# EAGLE design MJ838 - base - rev.1a (EAGLE 9.6.2)
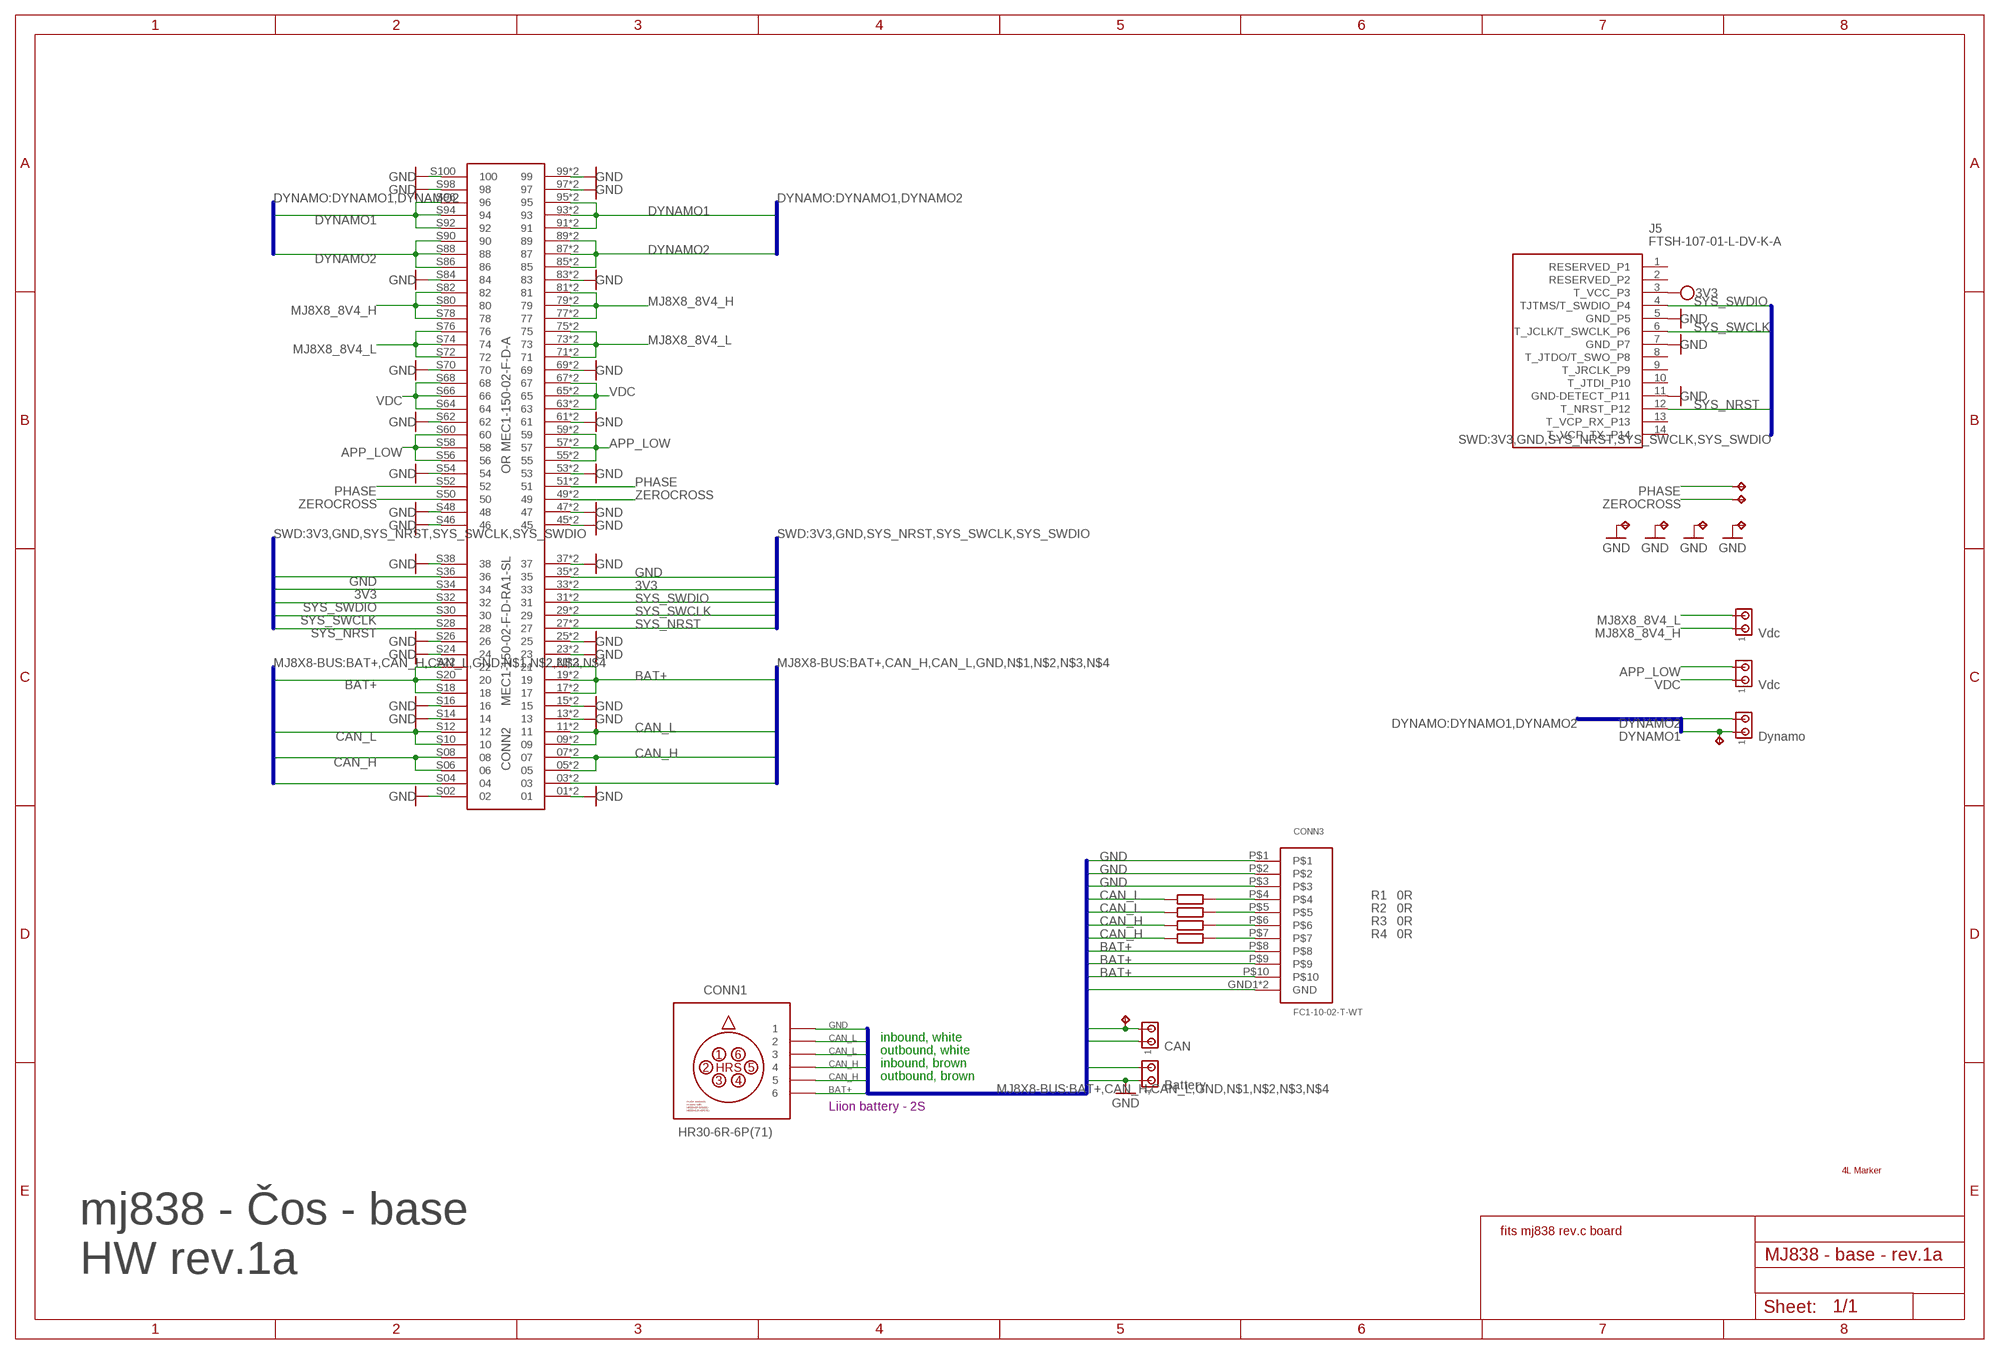
[diagram p0: schematic, sheet 1]

## Parts
CONN1  HR30-6R-6P(71)  HR-30-6R-6X  (no package)
CONN2  MEC1-150-02-F-D-RA1-SL  MEC1-150-02-F-D-AMEC1-150-02-F-D-COMBINED  [MEC1-150-02-F-D-COMBINED]
CONN3  FC1-10-02-T-WT  FC1-10-02-T-FFC_CONNECTOR  [SMD]
J2  Dynamo  MTA02-100  [10X02MTA]
J3  CAN  MTA02-100  [10X02MTA]
J4  Battery  MTA02-100  [10X02MTA]
J5  FTSH-107-01-L-DV-K-A  [FTSH10701LDVKA]
J6  Vdc  MTA02-100  [10X02MTA]
J7  Vdc  MTA02-100  [10X02MTA]
MARKER2  4 Layer marker  4L  [4L]
R1  0R  R-EU_R0402  [R0402]
R2  0R  R-EU_R0402  [R0402]
R3  0R  R-EU_R0402  [R0402]
R4  0R  R-EU_R0402  [R0402]
TP1  TPPAD1-13  [P1-13]
TP2  TPPAD1-13  [P1-13]
TP3  TPPAD1-13  [P1-13]
TP4  TPPAD1-13  [P1-13]
TP5  TPPAD1-13  [P1-13]
TP6  TPPAD1-13  [P1-13]
TP8  TPPAD1-13  [P1-13]
TP9  TPPAD1-13  [P1-13]

## Nets
3V3 [3V3]: CONN2.33 CONN2.R33 CONN2.S34 J5.3(T_VCC_P3)
APP_LOW [Vdc]: CONN2.55 CONN2.57 CONN2.59 CONN2.R55 CONN2.R57 CONN2.R59 CONN2.S56 CONN2.S58 CONN2.S60 J7.2
BAT+ [BAT+]: CONN1.6 CONN2.17 CONN2.19 CONN2.21 CONN2.R17 CONN2.R19 CONN2.R21 CONN2.S18 CONN2.S20 CONN2.S22 CONN3.P$8 CONN3.P$9 CONN3.P$10 J4.2
CAN_H [signal]: CONN1.4 CONN1.5 CONN2.05 CONN2.07 CONN2.R05 CONN2.R07 CONN2.S06 CONN2.S08 J3.2 R3.1 R4.1 TP6.TP
CAN_L [signal]: CONN1.2 CONN1.3 CONN2.09 CONN2.11 CONN2.R09 CONN2.R11 CONN2.S10 CONN2.S12 J3.1 R1.1 R2.1
DYNAMO1 [Vdynamo]: CONN2.91 CONN2.93 CONN2.95 CONN2.R91 CONN2.R93 CONN2.R95 CONN2.S92 CONN2.S94 CONN2.S96 J2.1 TP5.TP
DYNAMO2 [Vdynamo]: CONN2.85 CONN2.87 CONN2.89 CONN2.R85 CONN2.R87 CONN2.R89 CONN2.S86 CONN2.S88 CONN2.S90 J2.2
GND: CONN1.1 CONN2.01 CONN2.03 CONN2.13 CONN2.15 CONN2.23 CONN2.25 CONN2.35 CONN2.37 CONN2.45 CONN2.47 CONN2.53 CONN2.61 CONN2.69 CONN2.83 CONN2.97 CONN2.99 CONN2.R01 CONN2.R03 CONN2.R13 CONN2.R15 CONN2.R23 CONN2.R25 CONN2.R35 CONN2.R37 CONN2.R45 CONN2.R47 CONN2.R53 CONN2.R61 CONN2.R69 CONN2.R83 CONN2.R97 CONN2.R99 CONN2.S02 CONN2.S04 CONN2.S14 CONN2.S16 CONN2.S24 CONN2.S26 CONN2.S36 CONN2.S38 CONN2.S46 CONN2.S48 CONN2.S54 CONN2.S62 CONN2.S70 CONN2.S84 CONN2.S98 CONN2.S100 CONN3.GND1(GND) CONN3.GND2(GND) CONN3.P$1 CONN3.P$2 CONN3.P$3 J4.1 J5.5(GND_P5) J5.7(GND_P7) J5.11(GND-DETECT_P11) TP1.TP TP4.TP TP8.TP TP9.TP
MJ8X8_8V4_H [BAT+]: CONN2.77 CONN2.79 CONN2.81 CONN2.R77 CONN2.R79 CONN2.R81 CONN2.S78 CONN2.S80 CONN2.S82 J6.1
MJ8X8_8V4_L [BAT+]: CONN2.71 CONN2.73 CONN2.75 CONN2.R71 CONN2.R73 CONN2.R75 CONN2.S72 CONN2.S74 CONN2.S76 J6.2
N$1 [signal]: CONN3.P$4 R1.2
N$2 [signal]: CONN3.P$5 R2.2
N$3 [signal]: CONN3.P$6 R3.2
N$4 [signal]: CONN3.P$7 R4.2
PHASE [signal]: CONN2.51 CONN2.R51 CONN2.S52 TP3.TP
SYS_NRST [signal]: CONN2.27 CONN2.R27 CONN2.S28 J5.12(T_NRST_P12)
SYS_SWCLK [signal]: CONN2.29 CONN2.R29 CONN2.S30 J5.6(T_JCLK/T_SWCLK_P6)
SYS_SWDIO [signal]: CONN2.31 CONN2.R31 CONN2.S32 J5.4(TJTMS/T_SWDIO_P4)
VDC [Vdc]: CONN2.63 CONN2.65 CONN2.67 CONN2.R63 CONN2.R65 CONN2.R67 CONN2.S64 CONN2.S66 CONN2.S68 J7.1
ZEROCROSS [signal]: CONN2.49 CONN2.R49 CONN2.S50 TP2.TP
Unconnected: J5.1(RESERVED_P1) J5.2(RESERVED_P2) J5.8(T_JTDO/T_SWO_P8) J5.9(T_JRCLK_P9) J5.10(T_JTDI_P10) J5.13(T_VCP_RX_P13) J5.14(T_VCP_TX_P14)

## Buses
MJ8X8-BUS:BAT+,CAN_H,CAN_L,GND,N$1,N$2,N$3,N$4
SWD:3V3,GND,SYS_NRST,SYS_SWCLK,SYS_SWDIO
DYNAMO:DYNAMO1,DYNAMO2

## Notes on the sheet
- OR MEC1-150-02-F-D-A
- inbound, white
- outbound, white
- inbound, brown
- outbound, brown
- Liion battery - 2S
- fits mj838 rev.c board
- mj838 - Čos - base
  HW rev.1a

## Library data of the parts
CONN1 = HR30-6R-6P - PushPull Receptacle:HR-30-6R-6X
CONN2 = MEC1-150-X-X-D-RA1-SL-X:MEC1-150-02-F-D-A
CONN3 = FC1-10-02-T  - FFC Connector:FC1-10-02-T-FFC_CONNECTOR
J2-J4 J6 J7 = con-amp:MTA02-100: AMP connector
J5 = STM32 JTAG 1.27mm 14pin header:FTSH-107-01-L-DV-K-A: Headers & Wire Housings .050" Micro Terminal Strip Source: Datasheet <https://componentsearchengine.com/Datasheets/1/FTSH-107-01-L-DV-K-A.pdf>; DESCRIPTION: Headers & Wire Housings .050" Micro Terminal Strip; HEIGHT: 5.97mm; MANUFACTURER_NAME: SAMTEC; MANUFACTURER_PART_NUMBER: FTSH-107-01-L-DV-K-A; MOUSER_PART_NUMBER: 200-FTSH10701LDVKA; MOUSER_PRICE-STOCK: https://www.mouser.com/Search/Refine.aspx?Keyword=200-FTSH10701LDVKA
MARKER2 = Layer Markers:4L
R1-R4 = rcl:R-EU_: RESISTOR, European symbol; SPICEPREFIX: R
TP1-TP6 TP8 TP9 = testpad:TP: Test pad

## Net classes
0 GND: width 0.25 mm, drill 0.35 mm, clearance 0.19 mm
1 BAT+: width 0.5 mm, drill 0.35 mm, clearance 0.5 mm to class 0, clearance 0.5 mm
2 signal: width 0.25 mm, drill 0.35 mm, clearance 0.19 mm to class 0, clearance 0.19 mm to class 1, clearance 0.19 mm
3 3V3: width 0.25 mm, drill 0.35 mm, clearance 0.19 mm to class 0, clearance 0.19 mm to class 1, clearance 0.19 mm to class 2, clearance 0.19 mm
4 Vdc: width 0.5 mm, drill 0.35 mm, clearance 0.5 mm to class 0, clearance 0.5 mm to class 1, clearance 0.5 mm to class 2, clearance 0.5 mm to class 3, clearance 0.5 mm
5 Vdynamo: width 0.5 mm, drill 0.35 mm, clearance 0.5 mm to class 0, clearance 0.5 mm to class 1, clearance 0.5 mm to class 2, clearance 0.5 mm to class 3, clearance 0.5 mm to class 4, clearance 0.5 mm
6 Vac: width 0.5 mm, drill 0.35 mm, clearance 0.5 mm to class 0, clearance 0.5 mm to class 1, clearance 0.5 mm to class 2, clearance 0.5 mm to class 3, clearance 0.5 mm to class 4, clearance 0.5 mm to class 5, clearance 0.5 mm

## Board
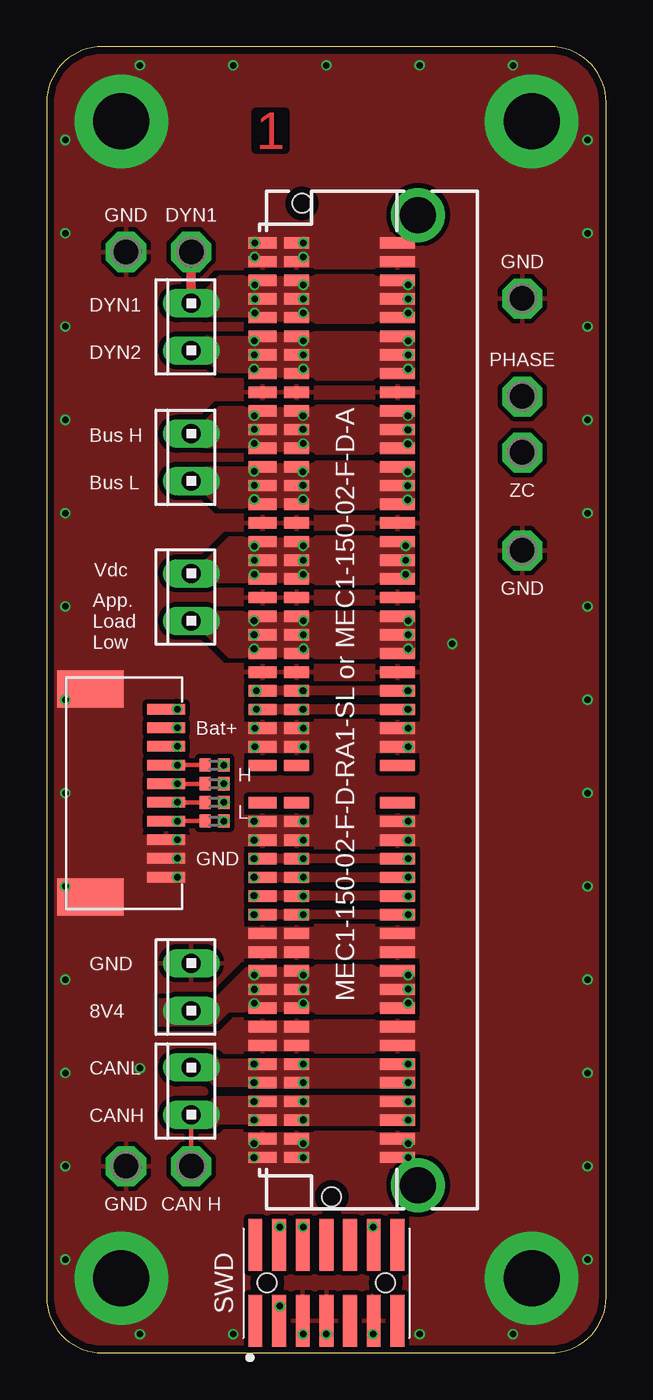
[diagram p1: board, top side]
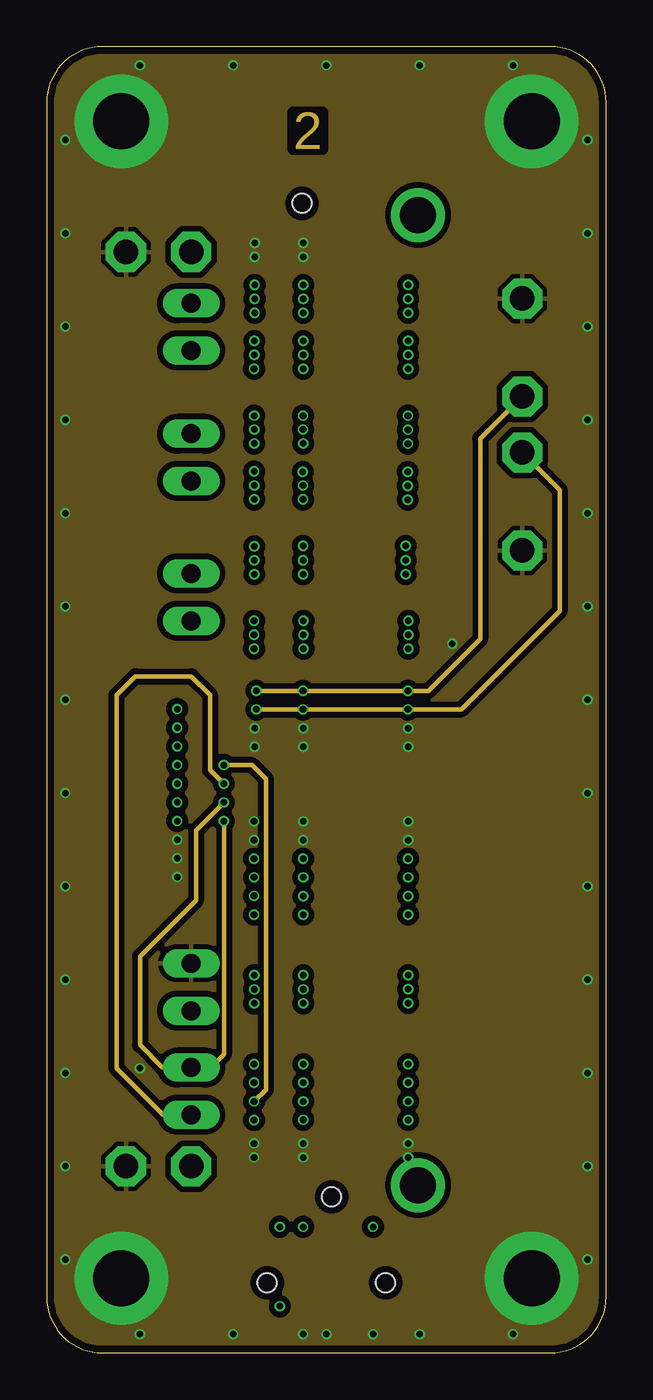
[diagram p2: board, inner layer Route2]
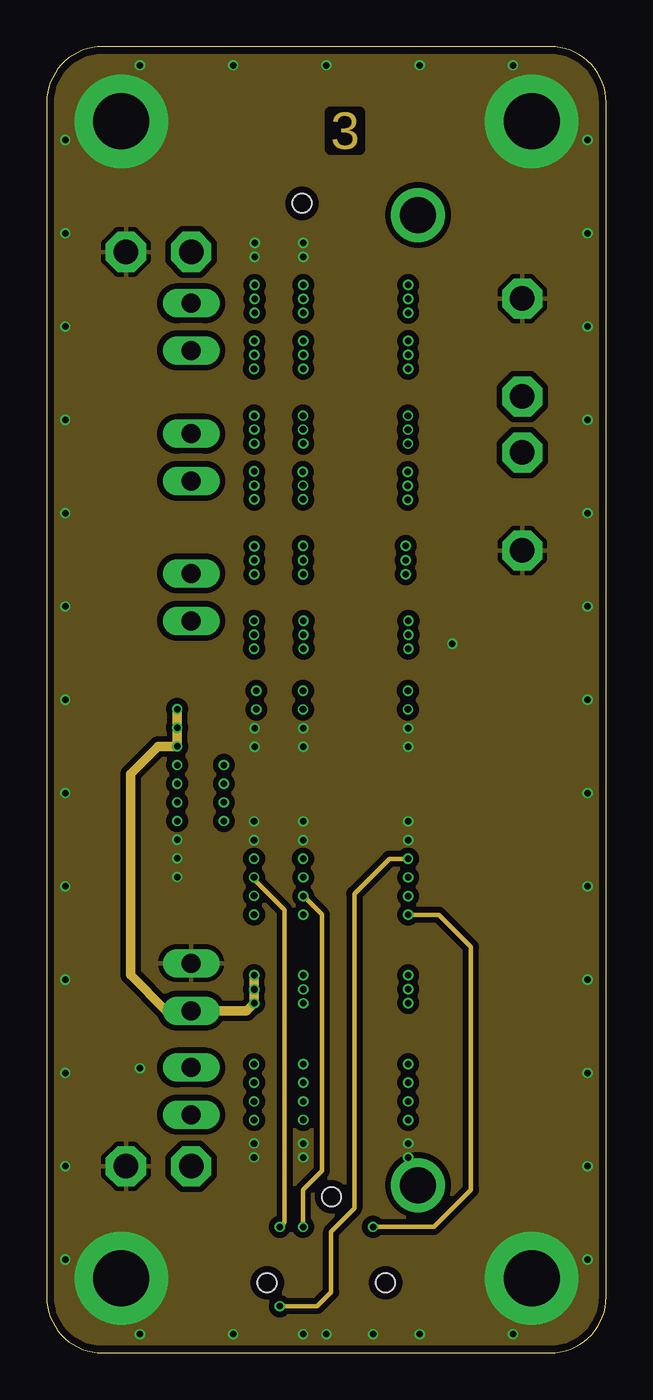
[diagram p3: board, inner layer Route15]
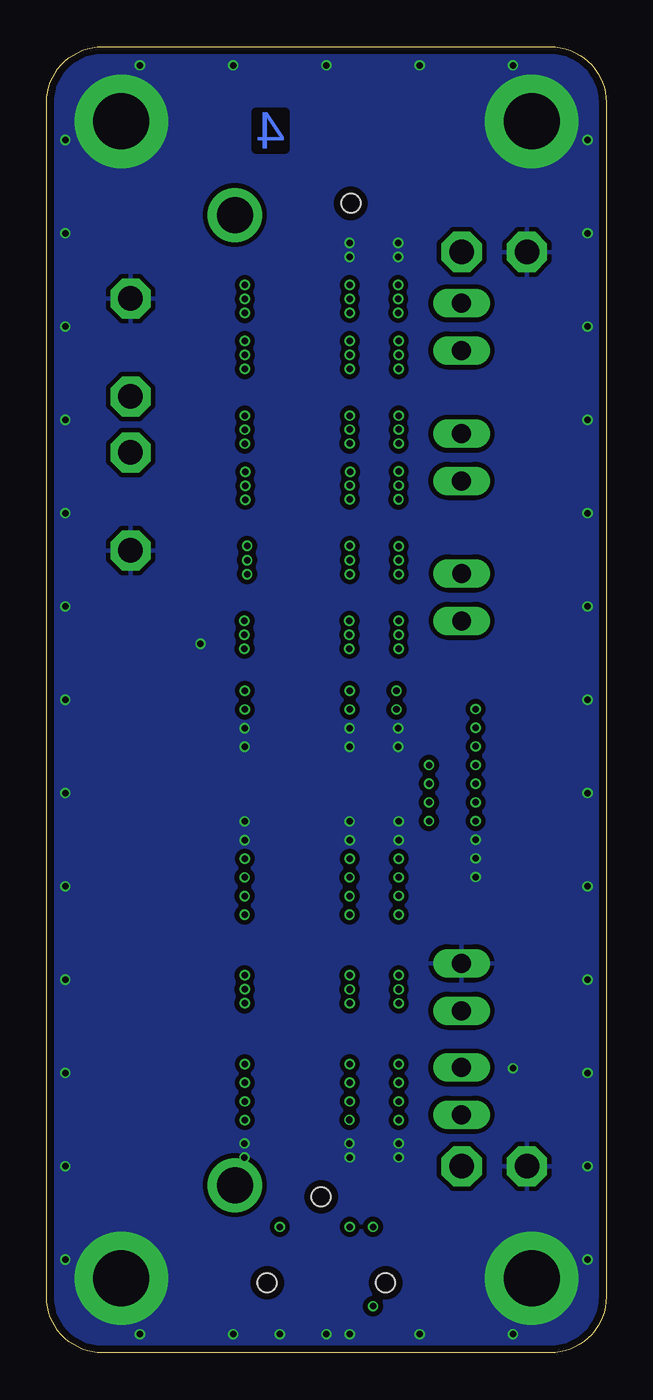
[diagram p4: board, bottom side, seen from below]

Size 30 x 70 mm. Coordinates in mm from the lower left corner, seen from the top.
Outline: 0,67 0,3 arc90 3,0 27,0 arc90 30,3 30,67 arc90 27,70 3,70 arc90 0,67
Copper layers (1*2*15*16): Top 0.035559375mm / dielectric 0.17018125mm / Route2 0.01778125mm / dielectric 47mil / Route15 0.01778125mm / dielectric 0.17018125mm / Bottom 0.035559375mm
Design rules "oshpark-4layer": minimum track width 5mil, minimum drill 10mil, track to track 5mil, track to pad 5mil, pad to pad 5mil, via to via 5mil, smd to smd 5mil, copper to edge 15mil, drill to drill 6mil, minimum pad ring 4mil, minimum via ring 4mil, stop-mask expansion 1.5mil, vias tented up to drill 0mil, thermal gap 10mil

### Footprints (pad centres in the part's own frame; a part is rotated, then mirrored left to right if it is on the bottom)
MEC1-150-02-F-D-COMBINED = smd 0.61 x 1.88: 01 -19.42,-2.711; 03 -18.42,-2.711; 05 -17.42,-2.711; 07 -16.42,-2.711; 09 -15.42,-2.711; 11 -14.42,-2.711; 13 -13.42,-2.711; 15 -12.42,-2.711; 17 -11.42,-2.711; 19 -10.42,-2.711; 21 -9.42,-2.711; 23 -8.42,-2.711; 25 -7.42,-2.711; 27 -6.42,-2.711; 29 -5.42,-2.711; 31 -4.42,-2.711; 33 -3.42,-2.711; 35 -2.42,-2.711; 37 -1.42,-2.711; 39 -0.42,-2.711; 43 1.58,-2.711; 45 2.58,-2.711; 47 3.58,-2.711; 49 4.58,-2.711; 51 5.58,-2.711; 53 6.58,-2.711; 55 7.58,-2.711; 57 8.58,-2.711; 59 9.58,-2.711; 61 10.58,-2.711; 63 11.58,-2.711; 65 12.58,-2.711; 67 13.58,-2.711; 69 14.58,-2.711; 71 15.58,-2.711; 73 16.58,-2.711; 75 17.58,-2.711; 77 18.58,-2.711; 79 19.58,-2.711; 81 20.58,-2.711; 83 21.58,-2.711; 85 22.58,-2.711; 87 23.58,-2.711; 89 24.58,-2.711; 91 25.58,-2.711; 93 26.58,-2.711; 95 27.58,-2.711; 97 28.58,-2.711; 99 29.58,-2.711 | smd 0.61 x 1.35: R01 -19.42,2.707; R03 -18.42,2.707; R05 -17.42,2.707; R07 -16.42,2.707; R09 -15.42,2.707; R11 -14.42,2.707; R13 -13.42,2.707; R15 -12.42,2.707; R17 -11.42,2.707; R19 -10.42,2.707; R21 -9.42,2.707; R23 -8.42,2.707; R25 -7.42,2.707; R27 -6.42,2.707; R29 -5.42,2.707; R31 -4.42,2.707; R33 -3.42,2.707; R35 -2.42,2.707; R37 -1.42,2.707; R39 -0.42,2.707; R43 1.58,2.707; R45 2.58,2.707; R47 3.58,2.707; R49 4.58,2.707; R51 5.58,2.707; R53 6.58,2.707; R55 7.58,2.707; R57 8.58,2.707; R59 9.58,2.707; R61 10.58,2.707; R63 11.58,2.707; R65 12.58,2.707; R67 13.58,2.707; R69 14.58,2.707; R71 15.58,2.707; R73 16.58,2.707; R75 17.58,2.707; R77 18.58,2.707; R79 19.58,2.707; R81 20.58,2.707; R83 21.58,2.707; R85 22.58,2.707; R87 23.58,2.707; R89 24.58,2.707; R91 25.58,2.707; R93 26.58,2.707; R95 27.58,2.707; R97 28.58,2.707; R99 29.58,2.707 | smd 0.61 x 1.52: S02 -19.42,4.522; S04 -18.42,4.522; S06 -17.42,4.522; S08 -16.42,4.522; S10 -15.42,4.522; S12 -14.42,4.522; S14 -13.42,4.522; S16 -12.42,4.522; S18 -11.42,4.522; S20 -10.42,4.522; S22 -9.42,4.522; S24 -8.42,4.522; S26 -7.42,4.522; S28 -6.42,4.522; S30 -5.42,4.522; S32 -4.42,4.522; S34 -3.42,4.522; S36 -2.42,4.522; S38 -1.42,4.522; S40 -0.42,4.522; S44 1.58,4.522; S46 2.58,4.522; S48 3.58,4.522; S50 4.58,4.522; S52 5.58,4.522; S54 6.58,4.522; S56 7.58,4.522; S58 8.58,4.522; S60 9.58,4.522; S62 10.58,4.522; S64 11.58,4.522; S66 12.58,4.522; S68 13.58,4.522; S70 14.58,4.522; S72 15.58,4.522; S74 16.58,4.522; S76 17.58,4.522; S78 18.58,4.522; S80 19.58,4.522; S82 20.58,4.522; S84 21.58,4.522; S86 22.58,4.522; S88 23.58,4.522; S90 24.58,4.522; S92 25.58,4.522; S94 26.58,4.522; S96 27.58,4.522; S98 28.58,4.522; S100 29.58,4.522 | drill 1.93 pad 2.21: SH1 -20.92,-3.81; SH2 31.08,-3.81 | hole 1.02: 31.703,2.408; -21.543,0.82
SMD = smd 1.98 x 3.56: GND1 -5.562,4.893; GND2 5.567,4.895 | smd 0.56 x 2.03: P$1 -4.5,0.85; P$2 -3.5,0.85; P$3 -2.5,0.85; P$4 -1.5,0.85; P$5 -0.5,0.85; P$6 0.5,0.85; P$7 1.5,0.85; P$8 2.5,0.85; P$9 3.5,0.85; P$10 4.5,0.85
10X02MTA = drill 1.016 long: 1 1.27,0; 2 -1.27,0
FTSH10701LDVKA = smd 0.74 x 2.79: 1 -3.81,-2.035; 2 -3.81,2.035; 3 -2.54,-2.035; 4 -2.54,2.035; 5 -1.27,-2.035; 6 -1.27,2.035; 7 0,-2.035; 8 0,2.035; 9 1.27,-2.035; 10 1.27,2.035; 11 2.54,-2.035; 12 2.54,2.035; 13 3.81,-2.035; 14 3.81,2.035 | hole 1.02: -3.175,0; 3.175,0
R0402 = smd 0.6 x 0.7: 1 -0.5,0; 2 0.5,0
P1-13 = drill 1.321 pad 2.159 octagon: TP 0,0

### Placement (x,y rotation side)
CONN2  16.1,29.9 90 top
CONN3  7.25,30 90 top
J2  7.75,54.98 90 top
J3  7.75,14.03 90 top
J4  7.75,19.61 90 top
J5  15,3.75 0 top
J6  7.75,47.99 90 top
J7  7.75,40.5 90 top
MARKER2  11,65.5 0 top
R1  9,28.5 180 top
R2  9,29.5 180 top
R3  9,30.5 180 top
R4  9,31.5 180 top
TP1  25.5,56.5 180 top
TP2  25.5,48.25 180 top
TP3  25.5,51.25 0 top
TP4  25.5,43 0 top
TP5  7.75,59 0 top
TP6  7.75,10 0 top
TP8  4.25,10 0 top
TP9  4.25,59 0 top

### Tracks (layer width: path | path; a pad name or v marks a point on that pad's centre or on a via)
3V3  (via drill 0.35)
  Top 0.25: J5.3 12.46,2.46 v12.5,2.5
  Route15 0.25: v19.38,26.48 18.38,26.48 16.5,24.61 16.5,7.75 15.25,6.5 15.25,3.25 14.5,2.5 v12.5,2.5
  other vias: 11.12,26.48 13.75,26.48
  pour Top (no thermals): 11,26.75 19.75,26.75 19.75,26.25 11,26.25
APP_LOW  (via drill 0.35)
  other vias: 13.77,39.23 13.77,38.48 13.77,37.73 11.12,37.73 11.12,38.48 11.12,39.23 19.39,39.23 19.39,38.48 19.39,37.73
  pour Top (no thermals): 10.82,39.78 19.75,39.78 19.75,37.18 10.82,37.18
  pour Top (no thermals): 8.5,39.75 8.5,38.5 9.75,37.25 11,37.25 11,39.75
BAT+  (via drill 0.35)
  Top 0.5: CONN3.P$10 v7,34.5 | CONN3.P$9 v7,33.5 | CONN3.P$8 v7,32.5
  Route15 0.5: v7,34.5 v7,33.5 v7,32.5 5.99,32.5 4.5,31.01 4.5,20.25 6.42,18.34 J4.2 10.73,18.34 v11.13,18.73 v11.13,19.48 v11.13,20.23
  other vias: 13.76,18.73 13.76,19.48 13.76,20.23 19.38,20.23 19.38,19.48 19.38,18.73
  pour Top (no thermals): 10.81,20.79 10.81,18.17 19.75,18.17 19.75,20.79
  pour Top (no thermals): 6,19 9,19 10.75,20.75 11.5,20.75 11.5,18.25 9.75,18.25 9,17.5 6,17.5
CAN_H  (via drill 0.35)
  Top 0.25: J3.2 TP6.TP
  Route2 0.25: J3.2 6.25,12.76 3.75,15.25 3.75,35.25 4.75,36.25 7.75,36.25 8.75,35.25 8.75,31.25 R3.1 | v11.12,13.47 11.75,14.11 11.75,30.75 11,31.5 R4.1
  other vias: 11.12,12.47 13.77,12.49 13.76,13.47 19.38,13.47 19.38,12.47 9.5,31.5 9.5,30.5
  pour Top (no thermals): 10.81,13.79 19.75,13.79 19.75,12.18 10.81,12.18
  pour Top (no thermals): 8.75,12 8.75,13.5 9,13.75 11,13.75 11,12.25 9.25,12.25 9,12
CAN_L  (via drill 0.35)
  Route2 0.25: R2.1 8,28 8,24.25 5,21.25 5,16.5 6.21,15.29 J3.1 8.79,15.29 9.5,16 R1.1
  other vias: 11.12,15.47 13.76,15.47 13.76,14.48 11.12,14.48 19.38,15.47 19.38,14.47 9.5,29.5 9.5,28.5
  pour Top (no thermals): 10.81,15.79 19.75,15.79 19.75,14.18 10.81,14.18
  pour Top (no thermals): 11,15.75 9.25,15.75 9,16 8.75,16 8.75,14.5 9,14.25 11,14.25
DYNAMO1  (via drill 0.35)
  Top 0.5: J2.1 TP5.TP
  other vias: 13.76,57.23 13.76,56.48 13.76,55.73 11.15,55.74 11.15,56.48 11.15,57.23 19.38,57.23 19.38,56.48 19.38,55.73
  pour Top (no thermals): 10.81,57.79 10.81,55.17 19.75,55.17 19.75,57.79
  pour Top (no thermals): 8.5,57 8.5,55.5 11,55.5 11,57.75 9.25,57.75
DYNAMO2  (via drill 0.35)
  other vias: 13.76,54.23 13.76,53.48 13.76,52.73 11.12,52.73 11.13,53.48 11.13,54.23 19.38,54.23 19.38,53.48 19.38,52.73
  pour Top (no thermals): 10.81,54.74 10.81,52.13 19.75,52.13 19.75,54.74
  pour Top (no thermals): 8.5,54.5 8.5,53.25 9.25,52.5 11,52.5 11,54.5
GND  (via drill 0.35, 3 pad 5)
  other vias: 4,66 26,66 26,4 4,4 13.76,59.48 13.76,58.73 11.16,59.49 11.15,58.73 13.76,33.48 13.76,32.48 11.15,32.48 11.15,33.48 13.76,28.48 13.75,27.48 11.12,27.48 11.12,11.22 11.12,10.47 13.76,10.47 13.77,11.22 15,1 15,69 1,35 29,35 10,69 5,69 20,69 25,69 29,65 1,55 1,65 1,50 1,45 1,40 29,55 29,50 29,45 29,40 29,30 29,25 29,20 29,15 29,5 1,30 1,25 1,20 1,15 1,5 5,1 10,1 20,1 25,1 21.75,38 1,60 29,60 29,10 1,10 19.39,33.48 19.39,32.48 19.39,28.48 19.39,27.48 19.39,11.22 19.39,10.47 7,27.5 7,26.5 7,25.5 17.5,1 13.75,1 5,15.25 11.12,28.48
  pour Top (isolate 0.254, rank 6): -2,72 32,72 32,-2 -2,-2
  pour Bottom (isolate 0.254, rank 6): 32,72 -2,72 -2,-2 32,-2
  pour Route2 (isolate 0.305, rank 6): 32,72 -2,72 -2,-2 32,-2
  pour Route15 (isolate 0.305, rank 6): 32,72 -2,72 -2,-2 32,-2
  pour Top (no thermals): 10.31,60.04 10.31,58.17 20.25,58.17 20.25,60.04
  pour Top (no thermals): 10.31,33.79 10.31,32.17 20.25,32.17 20.25,33.79
  pour Top (no thermals): 10.31,28.79 10.31,27.18 20.5,27.18 20.5,28.79
  pour Top (no thermals): 10.31,22.79 10.31,21.18 20.5,21.18 20.5,22.79
  pour Top (no thermals): 10.31,17.79 10.31,16.18 20.5,16.18 20.5,17.79
  pour Top (no thermals): 10.31,11.79 10.31,9.93 20.5,9.93 20.5,11.79
  pour Top (no thermals): 0.25,37 4.5,37 4.5,34.25 0.25,34.25
  pour Top (no thermals): 0.25,25.75 4.5,25.75 4.5,23 0.25,23
  pour Top (no thermals): 4.25,27.75 8.5,27.75 8.5,24.75 4.25,24.75
MJ8X8_8V4_H  (via drill 0.35)
  other vias: 11.13,50.23 11.13,49.48 11.13,48.73 13.76,48.73 13.75,49.48 13.75,50.23 19.37,50.23 19.37,49.48 19.37,48.73
  pour Top (no thermals): 10.82,50.78 10.82,48.17 19.75,48.17 19.75,50.78
  pour Top (no thermals): 8.5,50 8.5,48.5 11,48.5 11,50.75 9.25,50.75
MJ8X8_8V4_L  (via drill 0.35)
  other vias: 11.14,45.73 11.13,46.48 11.12,47.23 13.73,47.22 13.75,46.48 13.75,45.73 19.35,47.22 19.35,46.47 19.35,45.72
  pour Top (no thermals): 10.81,47.8 10.81,45.19 19.75,45.19 19.75,47.8
  pour Top (no thermals): 8.5,47.5 8.5,46 9.25,45.25 11,45.25 11,47.5
N$1  (via drill 0.35)
  Top 0.25: v7,28.5 CONN3.P$4 R1.2
N$2  (via drill 0.35)
  Top 0.25: v7,29.5 CONN3.P$5 R2.2
N$3  (via drill 0.35)
  Top 0.25: v7,30.5 CONN3.P$6 R3.2
N$4  (via drill 0.35)
  Top 0.25: v7,31.5 CONN3.P$7 R4.2
PHASE  (via drill 0.35)
  Route2 0.25: v11.25,35.48 v13.75,35.48 v19.37,35.48 20.48,35.48 23.25,38.25 23.25,49 TP3.TP
  pour Top (no thermals): 11,35.75 19.75,35.75 19.75,35.25 11,35.25
SYS_NRST  (via drill 0.35)
  Top 0.25: J5.12 17.54,6.71 v17.5,6.75
  Route15 0.25: v17.5,6.75 20.75,6.75 22.75,8.75 22.75,21.75 21.02,23.48 v19.39,23.48
  other vias: 11.12,23.48 13.76,23.48
  pour Top (no thermals): 11,23.75 19.75,23.75 19.75,23.25 11,23.25
SYS_SWCLK  (via drill 0.35)
  Top 0.25: J5.6 13.73,6.73 v13.75,6.75 | CONN2.R29 | v11.12,24.48 v11.12,24.49
  Route15 0.25: v13.75,6.75 13.75,8.75 14.75,9.75 14.75,23.49 v13.76,24.48
  other vias: 19.39,24.48
  pour Top (no thermals): 11,24.75 19.75,24.75 19.75,24.25 11,24.25
SYS_SWDIO  (via drill 0.35)
  Top 0.25: v12.5,6.75 12.46,6.79 J5.4
  Route15 0.25: v11.12,25.48 11.12,25.38 12.75,23.75 12.75,7 v12.5,6.75
  other vias: 13.76,25.48 19.39,25.48
  pour Top (no thermals): 11,25.75 19.75,25.75 19.75,25.25 11,25.25
VDC  (via drill 0.35)
  other vias: 11.13,42.48 11.13,41.73 13.75,41.73 13.75,42.48 11.13,43.23 13.75,43.25 19.25,43.25 19.25,42.48 19.25,41.73
  pour Top (no thermals): 10.81,43.78 10.81,41.17 19.75,41.17 19.75,43.78
  pour Top (no thermals): 8.5,42.5 8.5,41.25 11,41.25 11,43.75 9.75,43.75
ZEROCROSS  (via drill 0.35)
  Route2 0.25: v11.25,34.48 v13.75,34.48 v19.37,34.48 22.23,34.48 27.5,39.75 27.5,46.25 TP2.TP
  pour Top (no thermals): 11,34.75 19.75,34.75 19.75,34.25 11,34.25

### Text on the board
Top: GND | GND | GND | GND
Route2: GND | GND | GND | GND
Route15: GND | GND | GND | GND
Bottom: GND | GND | GND | GND
tPlace: GND | DYN1 | GND | DYN1 | DYN2 | PHASE | Bus H | Bus L | ZC | Vdc | GND | App. / Load / Low | MEC1-150-02-F-D-RA1-SL or MEC1-150-02-F-D-A | Bat+ | H | L | GND | GND | 8V4 | CANL | CANH | GND | CAN H | SWD
tStop: MJ838 base rev.1a